# EasyEDA Pro project RadioFox1.eprj, board PCB13
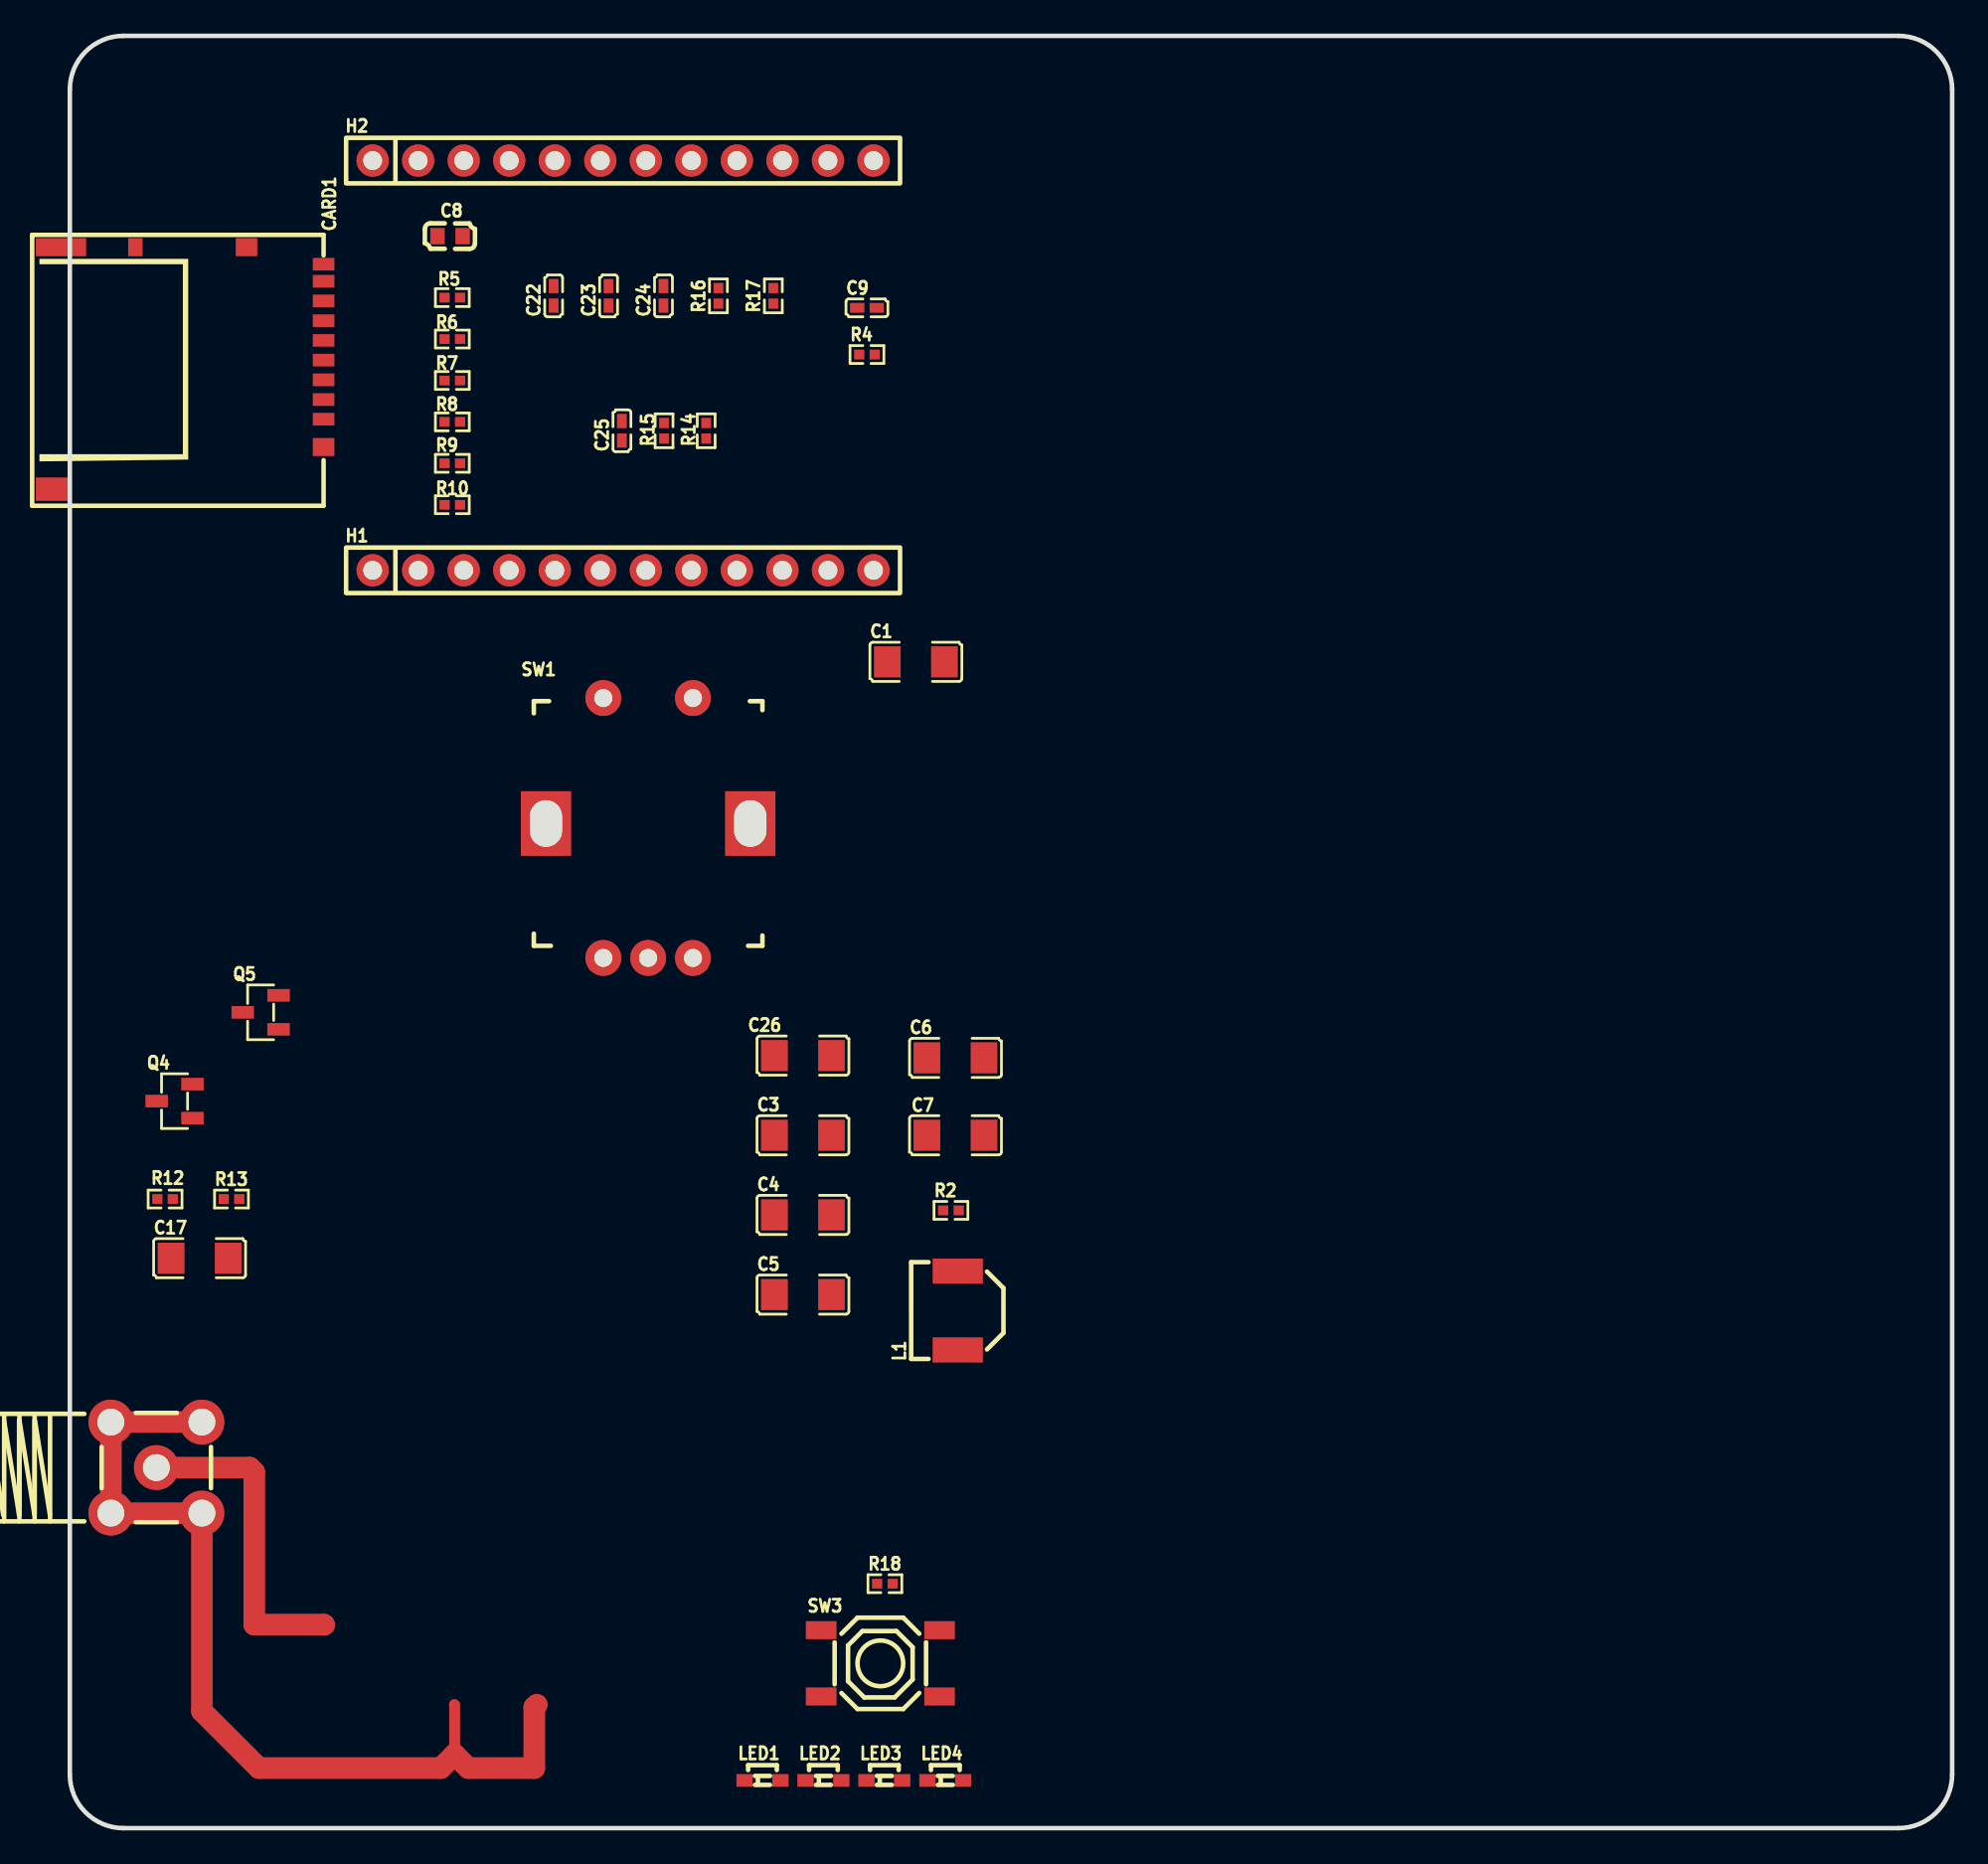
[diagram p5: board, top side]
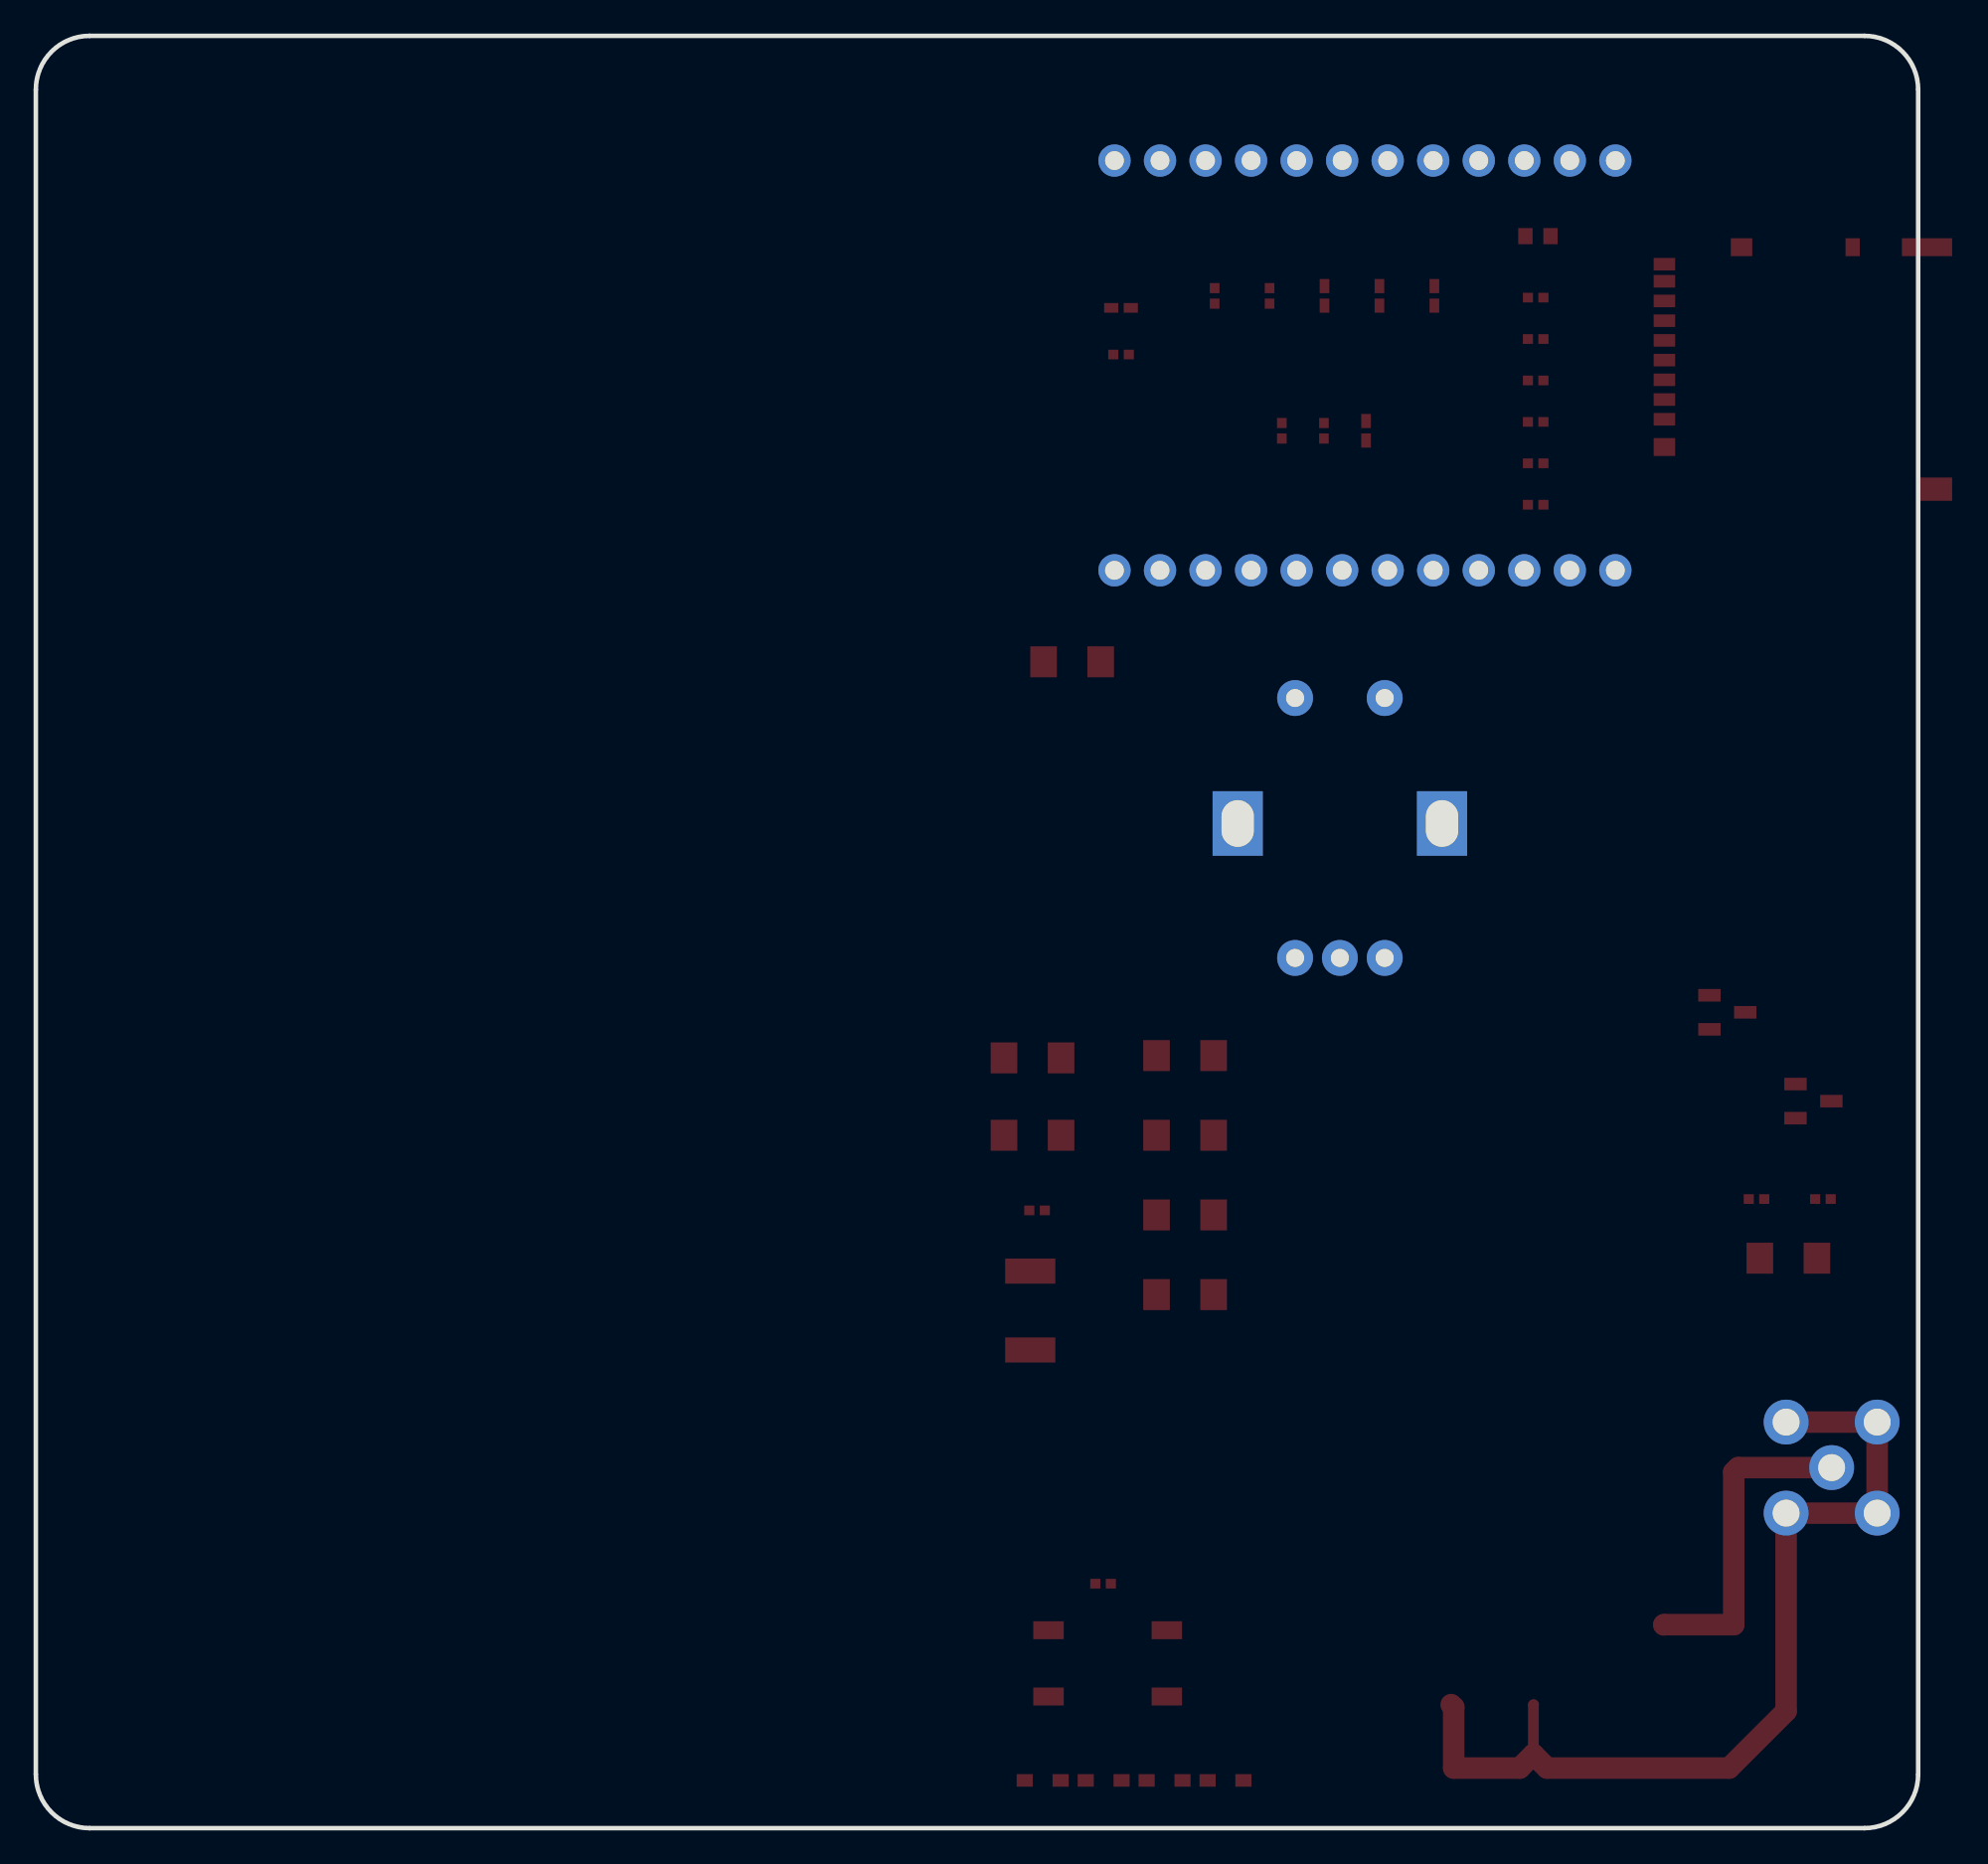
[diagram p6: board, bottom side, seen from below]

Outline 105 x 100 mm; copper layers: Top Layer, Bottom Layer. Coordinates in mm from the lower left corner of the outline.
Outline path: 0,97 0,3 arc(0.88,0.88) 3,0 102,0 arc(104.12,0.88) 105,3 105,97 arc(104.12,99.12) 102,100 3,100 arc(0.88,99.12) 0,97
Stack: Top Layer 0.035mm / Dielectric1 1.51mm FR4 er 4.5 / Bottom Layer 0.035mm

## Design rules (mm)
template: JLCPCB Capability(Two Layers Board)
spacing copperThickness1oz (default): track to track 0.102, other pairs 0.152 to 0.3
spacing copperThickness2oz: track to track 0.203, other pairs 0.152 to 0.3
track width copperThickness1oz (default): min 0.127, default 0.254, max 2.54
track width copperThickness2oz: min 0.203, default 0.254, max 2.54
differential pair differentialPair (default): width min 0.127, default 0.254, max 2.54; gap min 0.152, default 0.152
via viaSize (default): diameter min 0.5, default 0.61, max 10; hole min 0.3, default 0.305, max 6.3

## Placement (name value [footprint] x y rotation side)
C1  10uF  [C1206]  47.19 65.08 0 top
C3  22uF  [C1206]  40.89 38.66 0 top
C4  22uF  [C1206]  40.89 34.21 0 top
C5  22uF  [C1206]  40.89 29.77 0 top
C6  10uF  [C1206]  49.4 42.98 0 top
C7  10uF  [C1206]  49.4 38.66 180 top
C8  100nF  [C0603]  21.21 88.82 0 top
C9  100nF  [C0402]  44.46 84.82 0 top
C17  10uF  [C1206]  7.24 31.8 0 top
C22  47nF  [C0402]  26.99 85.49 90 top
C23  47nF  [C0402]  30.05 85.49 90 top
C24  47nF  [C0402]  33.11 85.49 90 top
C25  10nF  [C0402]  30.8 77.97 90 top
C26  22uF  [C1206]  40.89 43.1 0 top
CARD1  DM3AT-SF-PEJM5  [SD-SMD_DM3AT-SF-PEJM5]  6.6 81.46 270 top
H1  A2541HWV-12P  [HDR-TH_12P-P2.54-V-F]  30.86 70.18 0 top
H2  A2541HWV-12P  [HDR-TH_12P-P2.54-V-F]  30.86 93.04 0 top
L1  1uH  [IND-SMD_L5.4-W5.1_SPM5020]  49.53 28.88 90 top
LED1  MHS171WDT-C2  [LED-SMD_L2.0-W1.1-R-RD-SIDE_WHITE]  38.64 2.66 0 top
LED2  MHS171WDT-C2  [LED-SMD_L2.0-W1.1-R-RD-SIDE_WHITE]  42.04 2.66 0 top
LED3  MHS171WDT-C2  [LED-SMD_L2.0-W1.1-R-RD-SIDE_WHITE]  45.44 2.66 0 top
LED4  MHS171WDT-C2  [LED-SMD_L2.0-W1.1-R-RD-SIDE_WHITE]  48.84 2.66 0 top
Q4  2N7002_R1_00001  [SOT-23-3_L2.9-W1.3-P1.90-LS2.4-BR]  5.84 40.56 0 top
Q5  2N7002_R1_00001  [SOT-23-3_L2.9-W1.3-P1.90-LS2.4-BR]  10.64 45.52 0 top
R2  2Ω  [R0402]  49.15 34.47 0 top
R4  100kΩ  [R0402]  44.46 82.22 0 top
R5  20kΩ  [R0402]  21.34 85.4 0 top
R6  20kΩ  [R0402]  21.34 83.08 0 top
R7  20kΩ  [R0402]  21.34 80.77 0 top
R8  20kΩ  [R0402]  21.34 78.46 0 top
R9  20kΩ  [R0402]  21.34 76.15 0 top
R10  20kΩ  [R0402]  21.34 73.84 0 top
R12  10kΩ  [R0402]  5.31 35.1 0 top
R13  47kΩ  [R0402]  9.02 35.1 0 top
R14  100kΩ  [R0402]  35.5 77.97 90 top
R15  100kΩ  [R0402]  33.15 77.97 90 top
R16  47kΩ  [R0402]  36.18 85.49 90 top
R17  47kΩ  [R0402]  39.24 85.49 90 top
R18  10kΩ  [R0402]  45.47 13.64 0 top
RF1  KH-SMA-P-8496  [SMA-TH_KH-SMA-P-8496]  4.83 20.12 90 top
SW1  PEC11R-4220F-S0012  [SW-TH_PEC11R-4220F-S0012]  32.26 55.8 0 top
SW3  TS-1187A-B-A-B  [SW-SMD_4P-L5.1-W5.1-P3.70-LS6.5-TL-2]  45.21 9.2 0 top

## Footprints (pads in the part's own frame, mm; a bottom-side part is the same pattern mirrored in y, then rotated)
C0402
  rect 0.79x0.54 smd: 1(-0.545,0) 2(0.545,0)
C0603
  rect 0.8x0.9 smd: 1(-0.7,0) 2(0.7,0)
C1206
  rect 1.485x1.728 smd: 1(-1.593,0) 2(1.593,0)
HDR-TH_12P-P2.54-V-F
  round 1.8 hole 1.05: 1(-13.97,0) 2(-11.43,0) 3(-8.89,0) 4(-6.35,0) 5(-3.81,0) 6(-1.27,0) 7(1.27,0) 8(3.81,0) 9(6.35,0) 10(8.89,0) 11(11.43,0) 12(13.97,0)
IND-SMD_L5.4-W5.1_SPM5020
  rect 1.4x2.8 smd: 1(-2.2,0) 2(2.2,0)
LED-SMD_L2.0-W1.1-R-RD-SIDE_WHITE
  rect 0.9x0.7 smd: 1(1,0) 2(-1,0)
R0402
  rect 0.566x0.54 smd: 1(-0.433,0) 2(0.433,0)
SD-SMD_DM3AT-SF-PEJM5
  rect 0.7x1.2 smd: 1(2.85,7.55) 2(1.75,7.55) 3(0.65,7.55) 4(-0.45,7.55) 5(-1.55,7.55) 6(-2.65,7.55) 7(-3.75,7.55) 8(-4.85,7.55) 9(-5.8,7.55)
  rect 1x1.2 smd: 10(-6.75,3.25) 14(4.4,7.55)
  rect 1x0.8 smd: 11(-6.75,-2.95)
  rect 1x2.8 smd: 12(-6.75,-7.1)
  rect 1.3x1.9 smd: 13(6.75,-7.55)
SMA-TH_KH-SMA-P-8496
  round 2.5 hole 1.5: 1(-2.54,2.54) 2(2.54,2.54) 3(2.54,-2.54) 4(-2.54,-2.54) 5(0,0)
SOT-23-3_L2.9-W1.3-P1.90-LS2.4-BR
  rect 1.25x0.7 smd: 1(1,-0.95) 2(1,0.95) 3(-1,0)
SW-SMD_4P-L5.1-W5.1-P3.70-LS6.5-TL-2
  rect 1.7x1 smd: 1(-3.3,1.85) 2(3.3,1.85) 3(-3.3,-1.85) 4(3.3,-1.85)
SW-TH_PEC11R-4220F-S0012
  round 2 hole 1.005x1: 1(-2.499,7.25) 2(2.499,7.25) A(-2.499,-7.25) B(2.499,-7.25) C(0,-7.25)
  rect 2.8x3.6 hole 1.8x2.6: 3(-5.7,0.25) 3(5.7,0.25)

## Nets
As in the schematic, except:
GND: C1.1 C3.2 C4.2 C5.2 C6.1 C8.2 C9.1 C22.2 C23.2 C24.2 C25.2 C26.2 CARD1.6 CARD1.10 CARD1.12 CARD1.13 CARD1.14 H1.2 H2.2 H2.3 H2.11 H2.12 Q4.2 Q5.2 R2.2 R4.2 R12.2 R15.1 RF1.1 RF1.2 RF1.3 RF1.4 SW1.2 SW1.3 SW1.C SW3.3 SW3.4

Pads without a net: CARD1 9 11; H1 8; SW3 1

## Routing (per net, layer and track width the routed paths; a pad name or vN(x,y) marks a point on that pad's centre or on a via; arc(x,y) is an arc through that point)
GND: length 53.2
  Top Layer w0.6: 21.46,4.12 21.46,6.88 21.45,6.89
  Top Layer w1.2: 26.05,6.89 25.91,6.75 25.91,3.35 22.22,3.35 21.46,4.12 20.7,3.35 10.54,3.35 7.37,6.53 RF1.4 RF1.1 RF1.2 RF1.3
ANT: length 18
  Top Layer w1.2: RF1.5 10.03,20.12 10.29,19.86 10.29,11.35 14.18,11.35 14.19,11.34
